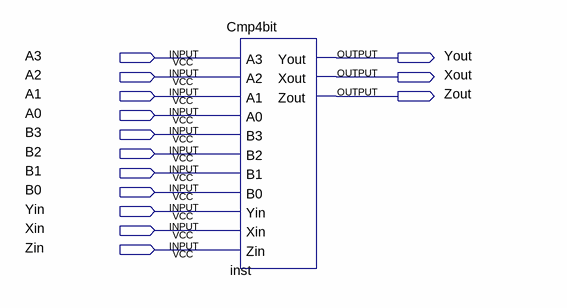
[diagram p0: schematic sheet]
// Quartus schematic Cmp4Demo.bdf as structural Verilog: 1 symbols, 14 pins
module Cmp4Demo (
  input  A3,
  input  A2,
  input  A1,
  input  A0,
  input  B3,
  input  B2,
  input  B1,
  input  B0,
  input  Yin,
  input  Xin,
  input  Zin,
  output Yout,
  output Xout,
  output Zout
);

  Cmp4bit inst (
    .A3(A3), .A2(A2), .A1(A1), .A0(A0), .B3(B3), .B2(B2), .B1(B1), .B0(B0), .Yin(Yin), .Xin(Xin), .Zin(Zin),
    .Yout(Yout), .Xout(Xout), .Zout(Zout));
endmodule
